# EAGLE design regulator_5v (EAGLE 7.1.0)
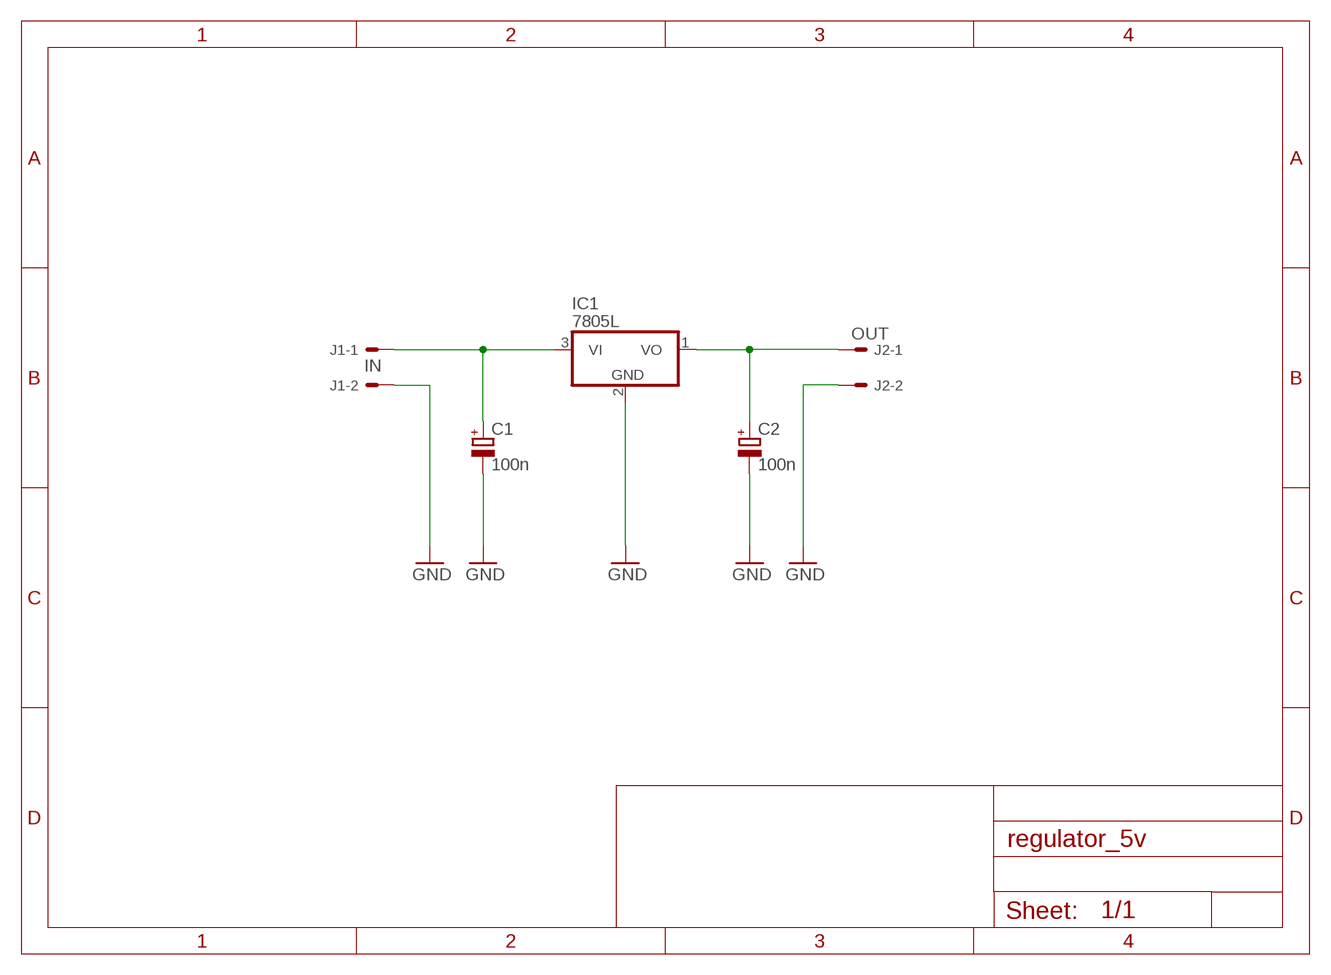
[diagram p0: schematic, sheet 1]

## Parts
C1  100n  CPOL-EUTT2D5  [TT2D5]
C2  100n  CPOL-EUTT2D5  [TT2D5]
IC1  7805L  [TO92]
J1  IN  22-27-2021-02  [6410-02]
J2  OUT  22-27-2021-02  [6410-02]

## Nets
GND: C1.- C2.- IC1.2(GND) J1.2 J2.2
N$1: C1.+ IC1.3(VI) J1.1
N$2: C2.+ IC1.1(VO) J2.1

## Library data of the parts
C1 C2 = resistor:CPOL-EU: POLARIZED CAPACITOR, European symbol
IC1 = linear:78*: Positive VOLTAGE REGULATOR Source: http://cache.national.com/ds/LM/LM78L05.pdf http://www.fairchildsemi.com/ds/LM/LM7805.pdf
J1 J2 = con-molex:22-?-02: CONNECTOR wire to board 2.54 mm (.1 inch) pitch header; OC_FARNELL: unknown; OC_NEWARK: unknown

## Board
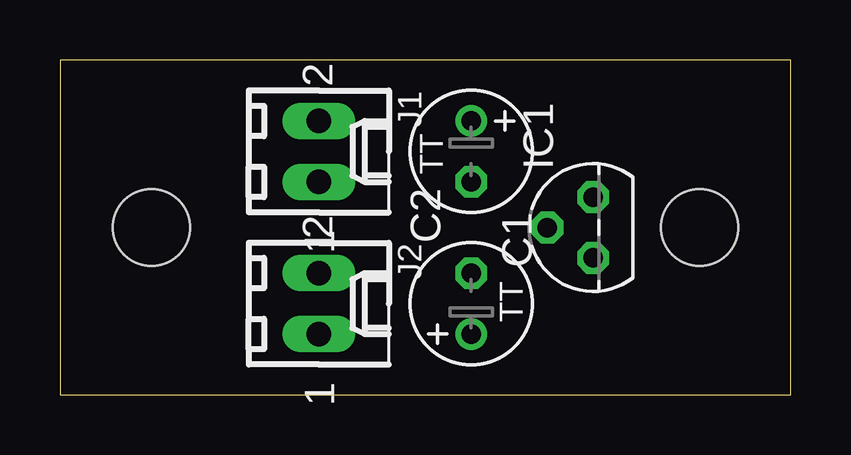
[diagram p1: board, top side]
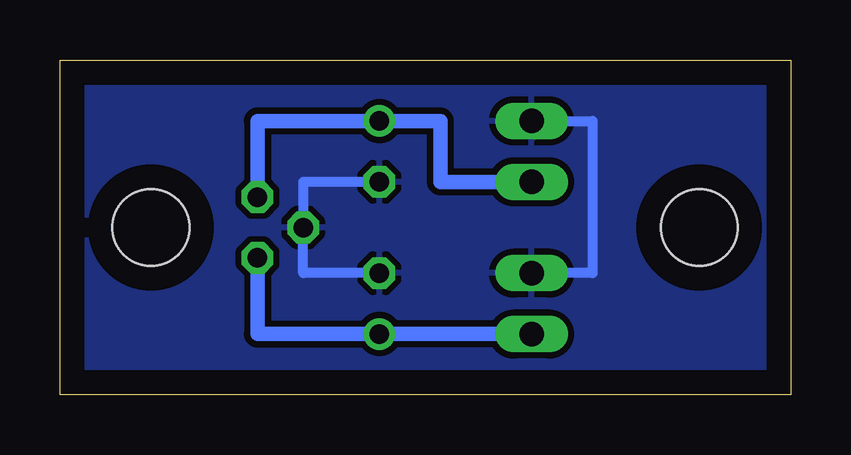
[diagram p2: board, bottom side, seen from below]

Size 30.46 x 13.97 mm. Coordinates in mm from the lower left corner, seen from the top.
Outline: 0,0 30.46,0 30.46,13.97 0,13.97 0,0
Copper layers (1*16): Top 0.035mm / dielectric 1.5mm / Bottom 0.035mm
Design rules "default *": minimum track width 10mil, minimum drill 24mil, track to track 8mil, track to pad 8mil, pad to pad 8mil, via to via 8mil, smd to smd 8mil, copper to edge 40mil, drill to drill 8mil, minimum pad ring 10mil, minimum via ring 8mil, stop-mask expansion 4mil, vias tented up to drill 0mil, thermal gap 10mil
Holes 3.2 mm at 3.81,6.99 26.67,6.99

### Footprints (pad centres in the part's own frame; a part is rotated, then mirrored left to right if it is on the bottom)
TT2D5 = drill 0.813: + -1.27,0 | drill 0.813 octagon: - 1.27,0
TO92 = drill 0.813 octagon: 1 -1.27,0; 2 0,1.905; 3 1.27,0
6410-02 = drill 1.016 long: 1 1.27,0; 2 -1.27,0

### Placement (x,y rotation side)
C1  17.14,10.16 270 top
C2  17.14,3.81 90 top
IC1  22.23,6.99 90 top
J1  10.79,10.16 270 top
J2  10.79,3.81 270 top

### Tracks (layer width: path | path; a pad name or v marks a point on that pad's centre or on a via)
GND
  Bottom 0.406: J1.2 8.26,11.43 8.26,5.08 J2.2 | C2.- 20.32,5.08 IC1.2 20.32,8.89 C1.-
  pour Bottom (isolate 0.254): 0,13.97 30.48,13.97 30.48,0 0,0
N$1
  Bottom 0.61: J1.1 14.61,8.89 14.61,11.43 C1.+ 22.23,11.43 IC1.3
N$2
  Bottom 0.61: J2.1 C2.+ 22.23,2.54 IC1.1